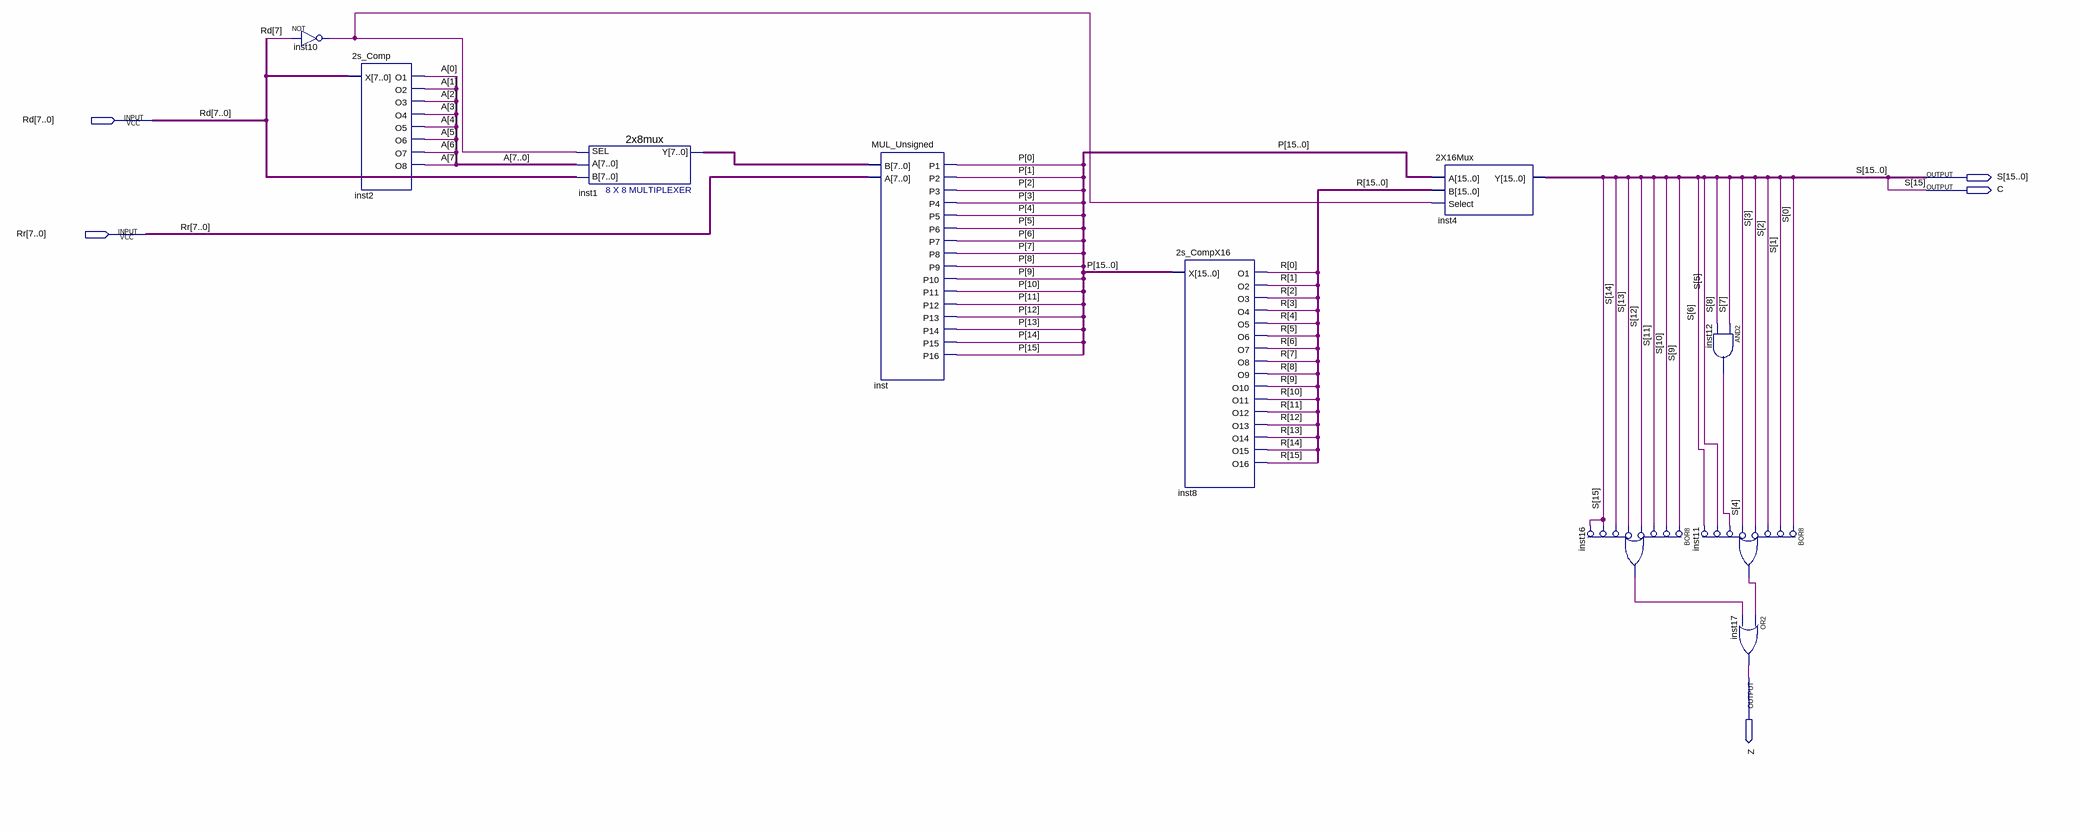
[diagram p0: schematic sheet]
// Quartus schematic MULSU.bdf as structural Verilog: 10 symbols, 5 pins
module MULSU (
  input  [7:0] Rd,
  input  [7:0] Rr,
  output [15:0] S,
  output C,
  output Z
);

  wire inst10_out, inst11_out, inst12_out, inst16_out;
  wire [7:0] A, inst1_y;
  wire [15:0] P, R;

  not inst10 (inst10_out, Rd[7]);
  \2s_Comp  inst2 (.X(Rd), .O1(A[0]), .O2(A[1]), .O3(A[2]), .O4(A[3]), .O5(A[4]), .O6(A[5]), .O7(A[6]), .O8(A[7]));
  \2x8mux  inst1 (.SEL(inst10_out), .A(A), .B(Rd), .Y(inst1_y));
  MUL_Unsigned inst (
    .B(inst1_y), .A(Rr), .P1(P[0]), .P2(P[1]), .P3(P[2]), .P4(P[3]), .P5(P[4]), .P6(P[5]), .P7(P[6]),
    .P8(P[7]), .P9(P[8]), .P10(P[9]), .P11(P[10]), .P12(P[11]), .P13(P[12]), .P14(P[13]), .P15(P[14]),
    .P16(P[15]));
  \2s_CompX16  inst8 (
    .X(P), .O1(R[0]), .O2(R[1]), .O3(R[2]), .O4(R[3]), .O5(R[4]), .O6(R[5]), .O7(R[6]), .O8(R[7]), .O9(R[8]),
    .O10(R[9]), .O11(R[10]), .O12(R[11]), .O13(R[12]), .O14(R[13]), .O15(R[14]), .O16(R[15]));
  \2X16Mux  inst4 (.A(P), .B(R), .Select(inst10_out), .Y({C, S[14:0]}));
  or inst16 (inst16_out, ~S[9], ~S[10], ~S[11], ~S[12], ~S[13], ~S[14], ~C, ~C);  // BOR8
  and inst12 (inst12_out, S[7], S[8]);
  or inst11 (inst11_out, ~S[0], ~S[1], ~S[2], ~S[3], ~S[4], ~inst12_out, ~S[5], ~S[6]);  // BOR8
  or inst17 (Z, inst11_out, inst16_out);

  assign S[15] = C;
endmodule
